# Altium schematic sheet PWR_MCU.SchDoc
size 420 x 297 mm; Address1: Address1; Address2: Address2; Address3: Address3; Address4: Address4; DocumentNumber: АБВГ.123456.001 Э3; SheetNumber: 1; SheetTotal: 3; Scale: 1:1; DocumentType: Схема электрическая принципиальная; FirstReferrence: АБВГ.123456.001
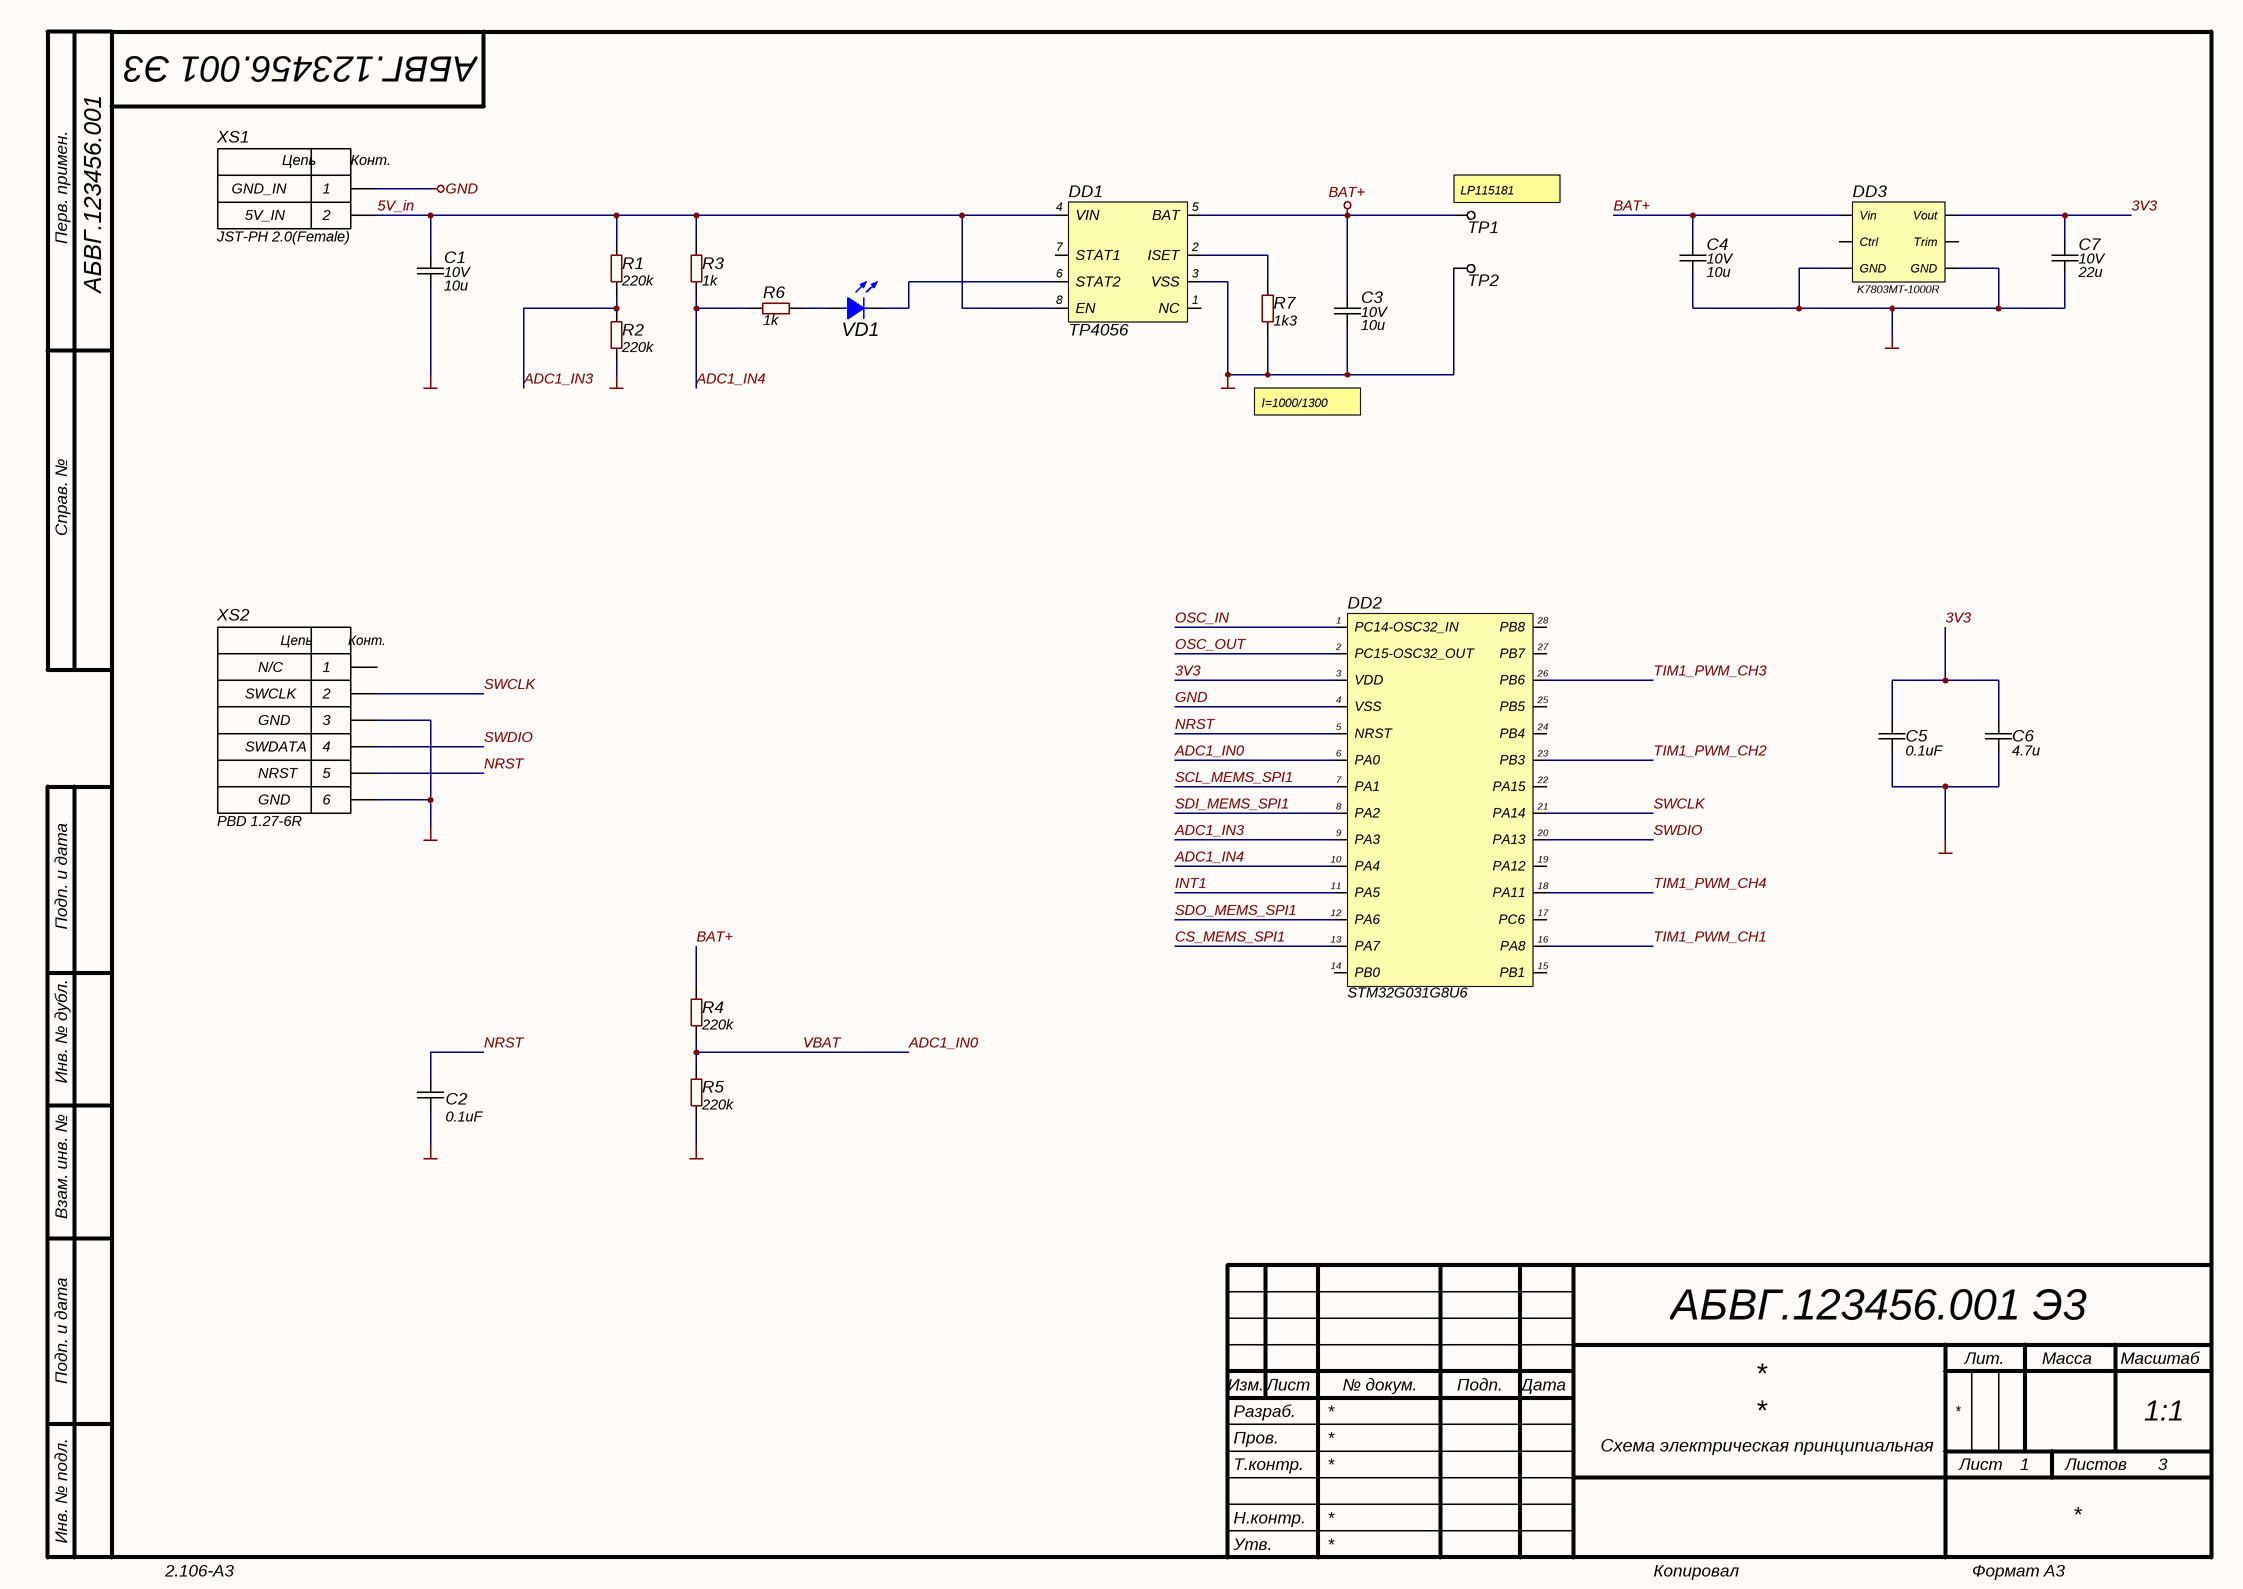
[diagram p0: PWR_MCU.SchDoc]

## Parts
C1  value 10u  Voltage: 10V  [CAP: 0603]  (hidden comment: 0603   1 мкФ ± 10 % X7R 16В)
C2  value 0.1uF  [CAP: 0603]
C3  value 10u  Voltage: 10V  [CAP: 0603]  (hidden comment: 0603   1 мкФ ± 10 % X7R 16В)
C4  value 10u  Voltage: 10V  [CAP: 0603]  (hidden comment: 0603   1 мкФ ± 10 % X7R 16В)
C5  value 0.1uF  [CAP: 0603]
C6  value 4.7u  [CAP: 0603]
C7  value 22u  Voltage: 10V  [CAP: 0603]  (hidden comment: 0603   1 мкФ ± 10 % X7R 16В)
DD1  TP4056  [8-ESOP]
DD2  STM32G031G8U6  [28-UFQFPN]
DD3  K7803MT-1000R  [DFN_K7805]
R1  value 220k  [RES: 0603]
R2  value 220k  [RES: 0603]
R3  value 1k  [RES: 0603]
R4  value 220k  [RES: 0603]
R5  value 220k  [RES: 0603]
R6  value 1k  [RES: 0603]
R7  value 1k3  [RES: 0603]
TP1  Testpoint_HS1mm  [TestPoint(without 3D)]  (value not drawn)
TP2  Testpoint_HS1mm  [TestPoint(without 3D)]  (value not drawn)
VD1  (no value)  [LED: 0603R]
XS1  JST-PH 2.0(Female)  [JST-PH 2.0(Female)]
XS2  PBD 1.27-6R  [CON: PLLD-6R(1.27)]

## Nets
BAT+: C3.2 C4.2 DD1.5(BAT) DD3.1(Vin) R4.2 TP1.1
GND: C1.1 C2.1 C3.1 C4.1 C5.1 C6.1 C7.1 DD1.3(VSS) DD2.4(VSS) DD3.2(GND) DD3.5(GND) R2.2 R5.1 R7.1 TP2.1 XS1.1 XS2.3 XS2.6
3V3: C5.2 C6.2 C7.2 DD2.3(VDD) DD3.3(Vout)
5V_in: C1.2 DD1.4(VIN) DD1.8(EN) R1.2 R3.2 XS1.2
ADC1_IN0: DD2.6(PA0) R4.1 R5.2  [also labelled VBAT]
ADC1_IN3: DD2.9(PA3) R1.1 R2.1
ADC1_IN4: DD2.10(PA4) R3.1 R6.2
CS_MEMS_SPI1: DD2.13(PA7)
INT1: DD2.11(PA5)
NRST: C2.2 DD2.5(NRST) XS2.5
OSC_IN: DD2.1(PC14-OSC32_IN)
OSC_OUT: DD2.2(PC15-OSC32_OUT)
SCL_MEMS_SPI1: DD2.7(PA1)
SDI_MEMS_SPI1: DD2.8(PA2)
SDO_MEMS_SPI1: DD2.12(PA6)
SWCLK: DD2.21(PA14) XS2.2
SWDIO: DD2.20(PA13) XS2.4
TIM1_PWM_CH1: DD2.16(PA8)
TIM1_PWM_CH2: DD2.23(PB3)
TIM1_PWM_CH3: DD2.26(PB6)
TIM1_PWM_CH4: DD2.18(PA11)
NetDD1_2: DD1.2(ISET) R7.2
NetDD1_6: DD1.6(STAT2) VD1.2(C)
NetR6_1: R6.1 VD1.1(A)

Not connected (* = marked no-connect by the designer): DD1 1(NC) 7(STAT1); DD2 14(PB0) 15(PB1) 17(PC6) 19(PA12) 22(PA15) 24(PB4) 25(PB5) 27(PB7) 28(PB8); DD3 4(Trim) 6(Ctrl); XS2 1

## Notes on the sheet
- GND_IN
- 5V_IN
- (near TP1) LP115181
- I=1000/1300
- N/C
- SWCLK
- GND
- SWDATA
- NRST
- Перв. примен.
- Справ. №
- Подп. и дата
- Инв. № дубл.
- Взам. инв. №
- Разраб.
- Изм.
- Лист
- № докум.
- Подп.
- Дата
- Лит.
- Масса
- Масштаб
- Пров.
- Т.контр.
- Листов
- Инв. № подл.
- Утв.
- Н.контр.
- 2.106-A3
- Копировал
- Формат А3
- (in symbol JST-PH 2.0(Female)) Цепь; Конт.
- (in symbol PBD 1.27-6R) Цепь; Конт.

## Library data of the parts
C1 C3 C4 = Ceramic_0603: Capacitor; Manufacturer: Yageo; PartNumber: CC0603KRX7R7BB104; ValueManufacturerPartNumber: Ceramic capacitor, 10u, X7R, ±10%, 10V, 0603, -55...+125°C; TypeCapacitor: Ceramic capacitor; Tolerance: ±10%; Package: 0603; HelpURL: https://www.digikey.com/product-detail/en/yageo/CC0603KRX7R7BB104/311-1088-1-ND/302998; Temperature: -55...+125°C; TypeDielectric: X7R
C2 C5 = Ceramic_0603: Manufacturer: Yageo; PartNumber: CC0603KRX7R7BB104; ValueManufacturerPartNumber: Ceramic capacitor, 0.1uF, X7R, ±10%, 16V, 0603, -55...+125°C; TypeCapacitor: Ceramic capacitor; Tolerance: ±10%; TypeDielectric: X7R; Voltage: 16V; Package: 0603; HelpURL: https://www.digikey.com/product-detail/en/yageo/CC0603KRX7R7BB104/311-1088-1-ND/302998; Temperature: -55...+125°C
C6 = Ceramic_0603: Manufacturer: Yageo; PartNumber: CC0603KRX7R7BB104; ValueManufacturerPartNumber: Ceramic capacitor, 4.7u, X7R, ±10%, 16V, 0603, -55...+125°C; TypeCapacitor: Ceramic capacitor; Tolerance: ±10%; TypeDielectric: X7R; Voltage: 16V; Package: 0603; HelpURL: https://www.digikey.com/product-detail/en/yageo/CC0603KRX7R7BB104/311-1088-1-ND/302998; Temperature: -55...+125°C
C7 = Ceramic_0603: Capacitor; Manufacturer: Yageo; PartNumber: CC0603KRX7R7BB104; ValueManufacturerPartNumber: Ceramic capacitor, 22u, X7R, ±10%, 10V, 0603, -55...+125°C; TypeCapacitor: Ceramic capacitor; Tolerance: ±10%; Package: 0603; HelpURL: https://www.digikey.com/product-detail/en/yageo/CC0603KRX7R7BB104/311-1088-1-ND/302998; Temperature: -55...+125°C; TypeDielectric: X7R
DD1 = TP4056: Linear Li-Ion Battery Charger; ComponentLink1Description: Datasheet; ComponentLink1URL: https://static.chipdip.ru/lib/848/DOC018848830.pdf
DD2 = STM32G031G8U6: Cortex-M0+; ComponentLink1Description: Documentation; ComponentLink1URL: https://www.st.com/en/microcontrollers-microprocessors/stm32g031g8.html
DD3 = K7805MT-500R: DC/DC converter; ComponentLink1Description: Datasheet; ComponentLink1URL: https://www.mornsun-power.com/html/pdf/K7805MT-500R4.html
R1-R7 = Resistor_0603: Manufacturer: Yageo; PartNumber: RC0603JR-07100RL; TypeResistor: Resistor film; Power: 0.1W; Package: 0603; HelpURL: https://www.digikey.com/product-detail/en/yageo/RC0603JR-07100RL/311-100GRCT-ND/729644; ValueManufacturerPartNumber: =TypeResistor+', '+Value+', '+Tolerance+', '+Package+', '+Power+', '+Temperature; Temperature: -55...+125°C
VD1 = LED_single: ValueManufacturerPartNumber: LED, Green, *, *, *, -55...+150°C; TypeDiode: LED; ColorParameter: Green; Manufacturer: *; Package: *; HelpURL: *; Temperature: -55...+150°C; Current: *; VoltageDrop: *; PartNumber: *; Color: GREEN
XS2 = PBD 1.27-6R: DS1065-14-2X3S8BR